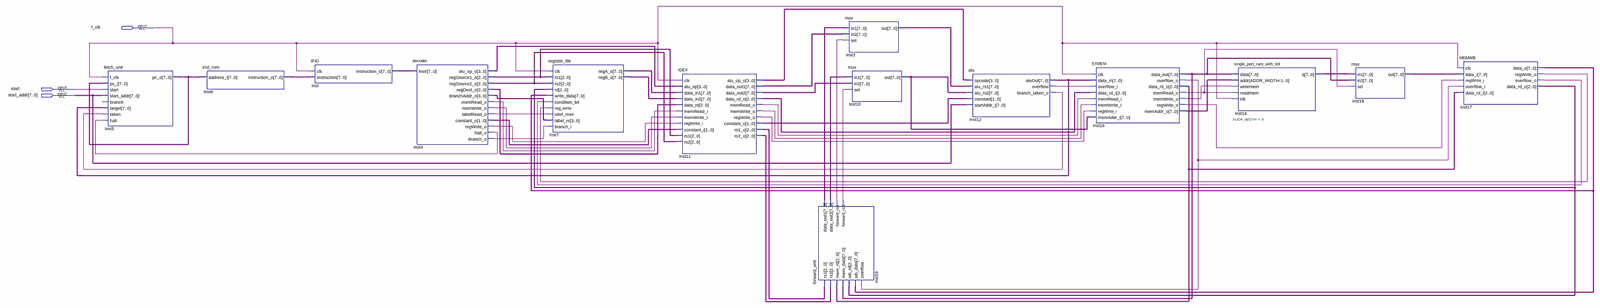
[diagram p0: schematic sheet, whole]
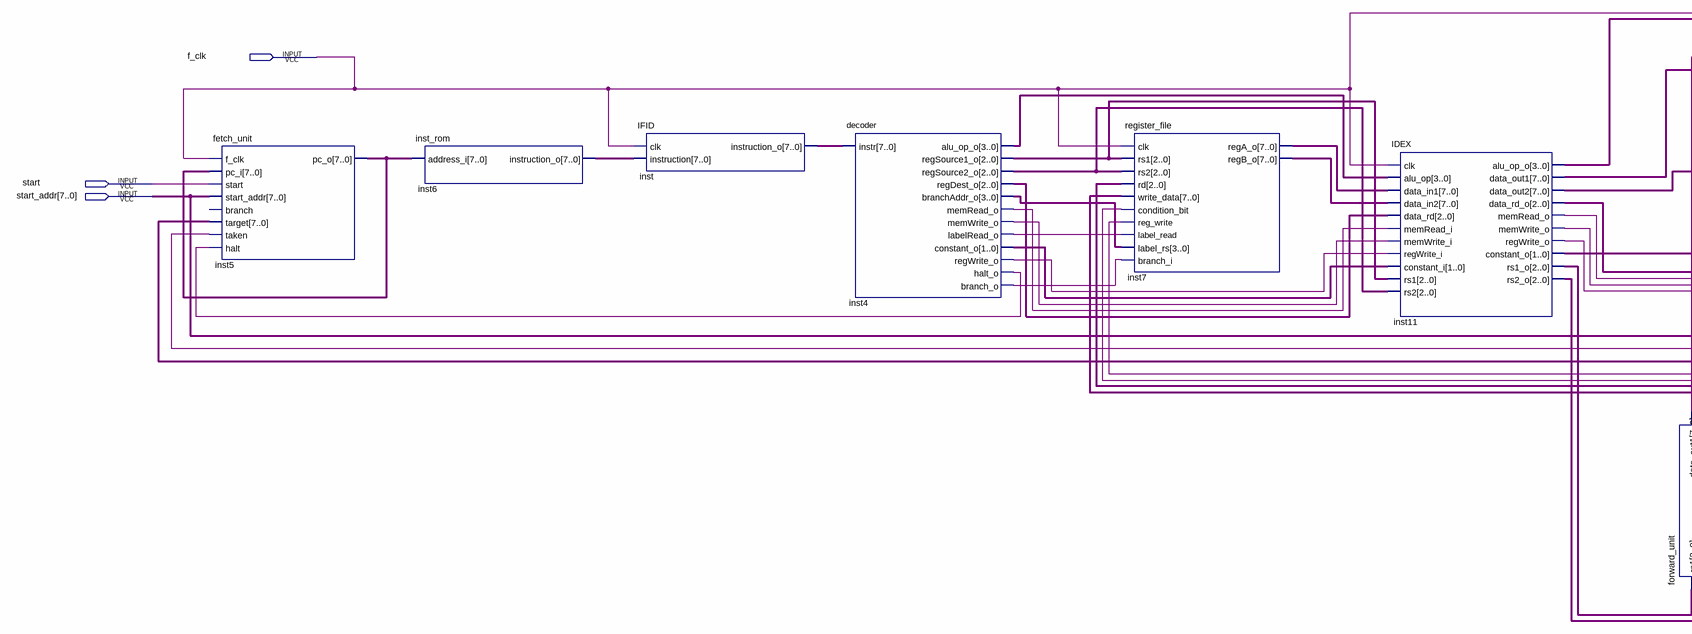
[diagram p1: schematic sheet, left part]
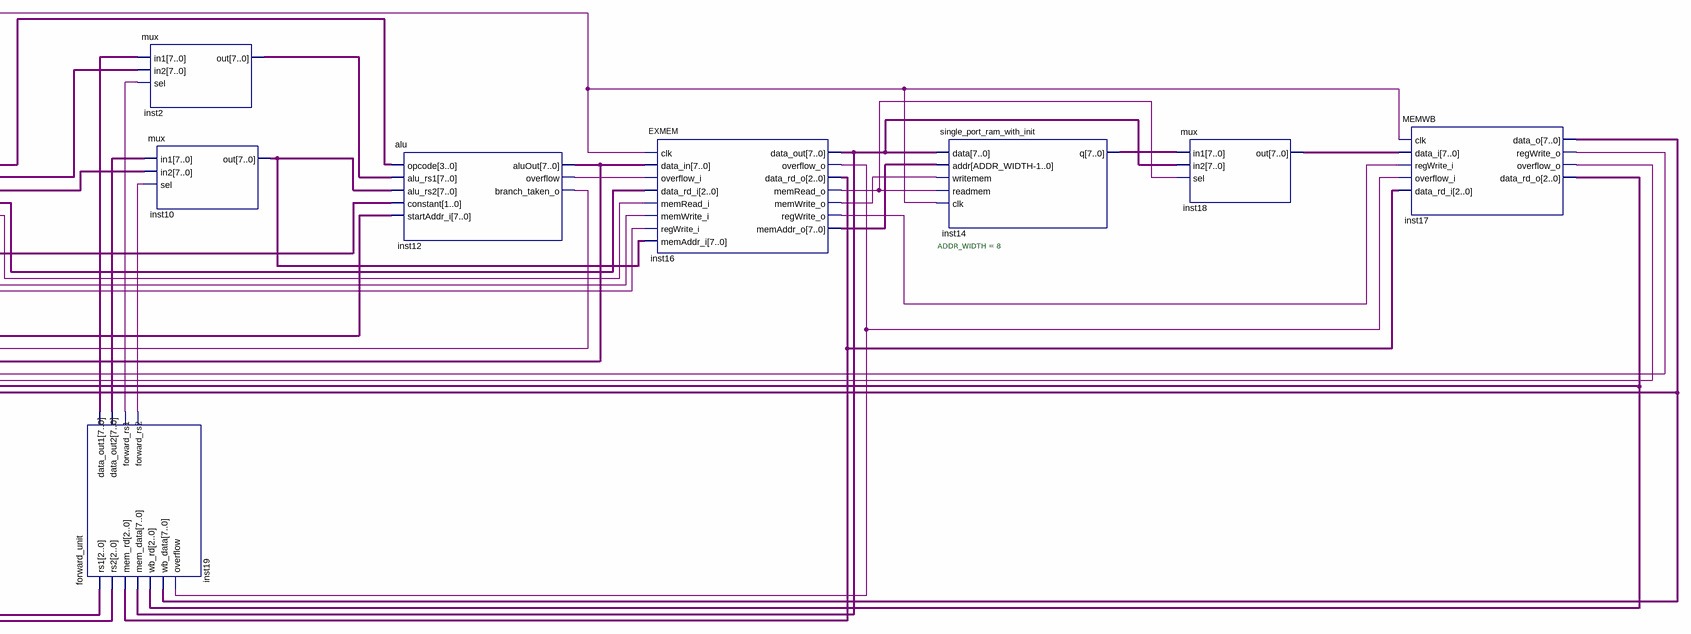
[diagram p2: schematic sheet, right part]
// Quartus schematic lab2.bdf as structural Verilog: 14 symbols, 3 pins
module lab2 (
  input  f_clk,
  input  start,
  input  [7:0] start_addr
);

  wire inst4_branch_o, inst4_halt_o, inst4_labelread_o, inst4_memread_o, inst4_memwrite_o, inst4_regwrite_o,
       inst11_memread_o, inst11_memwrite_o, inst11_regwrite_o, inst12_branch_taken_o, inst12_overflow,
       inst16_memread_o, inst16_memwrite_o, inst16_overflow_o, inst16_regwrite_o, inst17_overflow_o,
       inst17_regwrite_o, inst19_forward_rs1, inst19_forward_rs2;
  wire [1:0] inst4_constant_o, inst11_constant_o;
  wire [2:0] inst4_regdest_o, inst4_regsource1_o, inst4_regsource2_o, inst11_data_rd_o, inst11_rs1_o,
       inst11_rs2_o, inst16_data_rd_o, inst17_data_rd_o;
  wire [3:0] inst4_alu_op_o, inst4_branchaddr_o, inst11_alu_op_o;
  wire [7:0] inst2_out, inst5_pc_o, inst6_instruction_o, inst7_rega_o, inst7_regb_o, inst10_out,
       inst11_data_out1, inst11_data_out2, inst12_aluout, inst14_q, inst16_data_out, inst16_memaddr_o,
       inst17_data_o, inst18_out, inst19_data_out1, inst19_data_out2, inst_instruction_o;

  fetch_unit inst5 (
    .f_clk(f_clk), .pc_i(inst5_pc_o), .start(start), .start_addr(start_addr), .target(inst12_aluout),
    .taken(inst12_branch_taken_o), .halt(inst4_halt_o), .pc_o(inst5_pc_o));  // open: branch
  inst_rom inst6 (.address_i(inst5_pc_o), .instruction_o(inst6_instruction_o));
  IFID inst (.clk(f_clk), .instruction(inst6_instruction_o), .instruction_o(inst_instruction_o));
  decoder inst4 (
    .instr(inst_instruction_o), .alu_op_o(inst4_alu_op_o), .regSource1_o(inst4_regsource1_o),
    .regSource2_o(inst4_regsource2_o), .regDest_o(inst4_regdest_o), .branchAddr_o(inst4_branchaddr_o),
    .memRead_o(inst4_memread_o), .memWrite_o(inst4_memwrite_o), .labelRead_o(inst4_labelread_o),
    .constant_o(inst4_constant_o), .regWrite_o(inst4_regwrite_o), .halt_o(inst4_halt_o),
    .branch_o(inst4_branch_o));
  register_file inst7 (
    .clk(f_clk), .rs1(inst4_regsource1_o), .rs2(inst4_regsource2_o), .rd(inst17_data_rd_o),
    .write_data(inst17_data_o), .condition_bit(inst17_overflow_o), .reg_write(inst17_regwrite_o),
    .label_read(inst4_labelread_o), .label_rs(inst4_branchaddr_o), .branch_i(inst4_branch_o),
    .regA_o(inst7_rega_o), .regB_o(inst7_regb_o));
  IDEX inst11 (
    .clk(f_clk), .alu_op(inst4_alu_op_o), .data_in1(inst7_rega_o), .data_in2(inst7_regb_o),
    .data_rd(inst4_regdest_o), .memRead_i(inst4_memread_o), .memWrite_i(inst4_memwrite_o),
    .regWrite_i(inst4_regwrite_o), .constant_i(inst4_constant_o), .rs1(inst4_regsource1_o),
    .rs2(inst4_regsource2_o), .alu_op_o(inst11_alu_op_o), .data_out1(inst11_data_out1),
    .data_out2(inst11_data_out2), .data_rd_o(inst11_data_rd_o), .memRead_o(inst11_memread_o),
    .memWrite_o(inst11_memwrite_o), .regWrite_o(inst11_regwrite_o), .constant_o(inst11_constant_o),
    .rs1_o(inst11_rs1_o), .rs2_o(inst11_rs2_o));
  forward_unit inst19 (
    .rs1(inst11_rs1_o), .rs2(inst11_rs2_o), .mem_rd(inst16_data_rd_o), .mem_data(inst16_data_out),
    .wb_rd(inst17_data_rd_o), .wb_data(inst17_data_o), .overflow(inst16_overflow_o),
    .data_out1(inst19_data_out1), .data_out2(inst19_data_out2), .forward_rs1(inst19_forward_rs1),
    .forward_rs2(inst19_forward_rs2));
  mux inst2 (.in1(inst19_data_out1), .in2(inst11_data_out1), .sel(inst19_forward_rs1), .out(inst2_out));
  mux inst10 (.in1(inst19_data_out2), .in2(inst11_data_out2), .sel(inst19_forward_rs2), .out(inst10_out));
  alu inst12 (
    .opcode(inst11_alu_op_o), .alu_rs1(inst2_out), .alu_rs2(inst10_out), .constant(inst11_constant_o),
    .startAddr_i(start_addr), .aluOut(inst12_aluout), .overflow(inst12_overflow),
    .branch_taken_o(inst12_branch_taken_o));
  EXMEM inst16 (
    .clk(f_clk), .data_in(inst12_aluout), .overflow_i(inst12_overflow), .data_rd_i(inst11_data_rd_o),
    .memRead_i(inst11_memread_o), .memWrite_i(inst11_memwrite_o), .regWrite_i(inst11_regwrite_o),
    .memAddr_i(inst10_out), .data_out(inst16_data_out), .overflow_o(inst16_overflow_o),
    .data_rd_o(inst16_data_rd_o), .memRead_o(inst16_memread_o), .memWrite_o(inst16_memwrite_o),
    .regWrite_o(inst16_regwrite_o), .memAddr_o(inst16_memaddr_o));
  single_port_ram_with_init #(.ADDR_WIDTH(8)) inst14 (
    .data(inst16_data_out), .addr(inst16_memaddr_o), .writemem(inst16_memwrite_o),
    .readmem(inst16_memread_o), .clk(f_clk), .q(inst14_q));
  mux inst18 (.in1(inst14_q), .in2(inst16_data_out), .sel(inst16_memread_o), .out(inst18_out));
  MEMWB inst17 (
    .clk(f_clk), .data_i(inst18_out), .regWrite_i(inst16_regwrite_o), .overflow_i(inst16_overflow_o),
    .data_rd_i(inst16_data_rd_o), .data_o(inst17_data_o), .regWrite_o(inst17_regwrite_o),
    .overflow_o(inst17_overflow_o), .data_rd_o(inst17_data_rd_o));
endmodule
